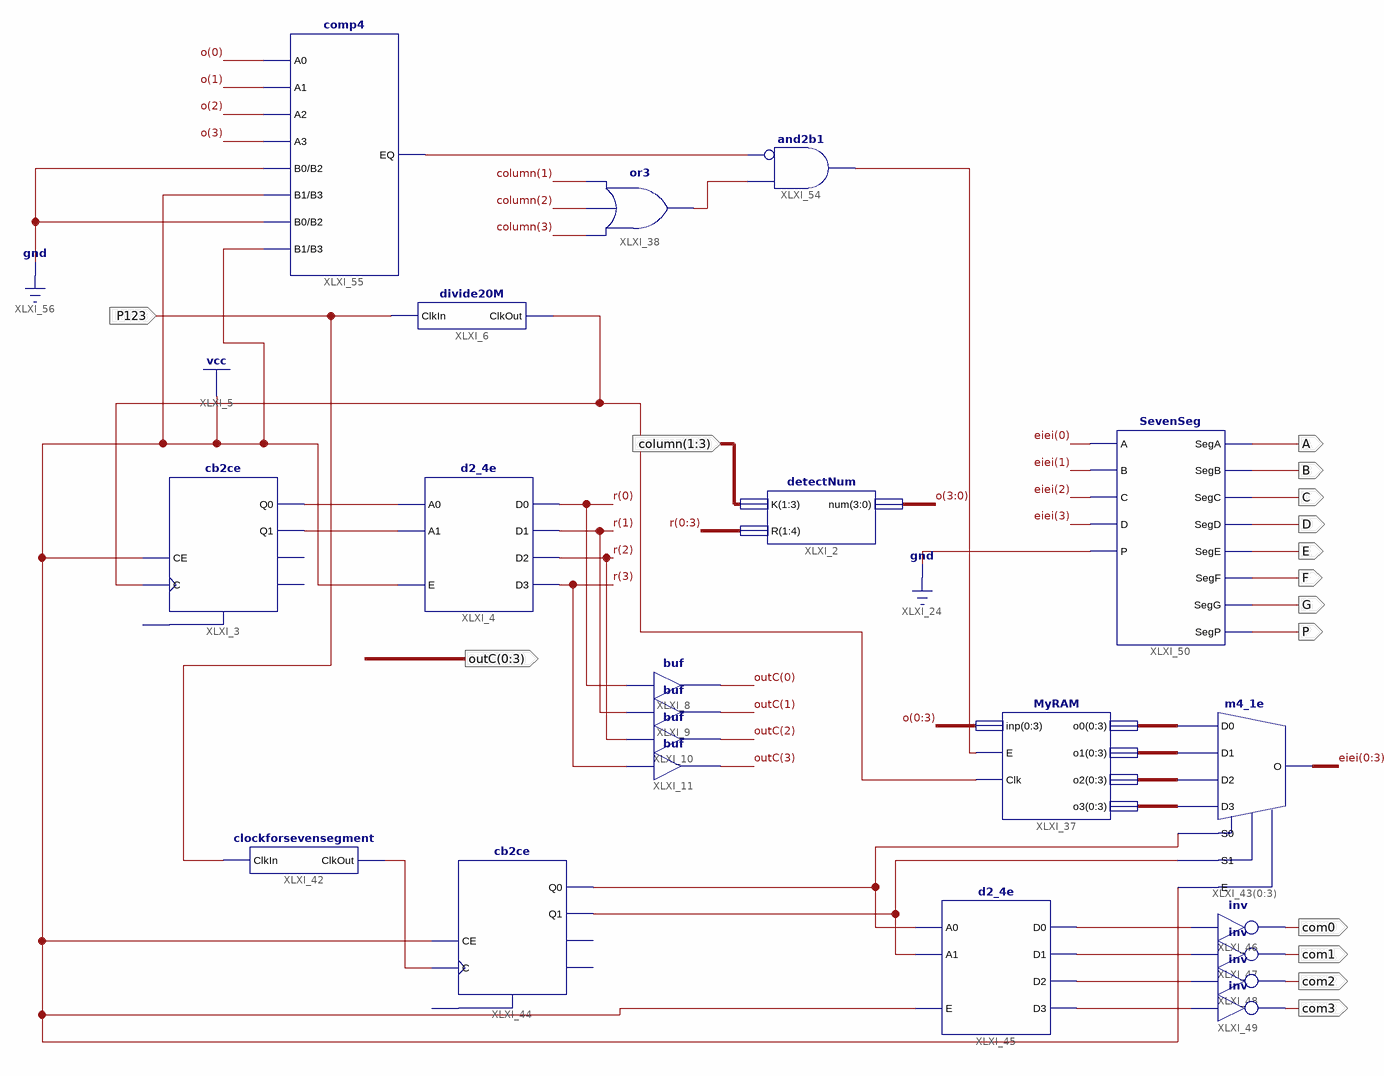
[diagram p0: schematic sheet 1]
// Xilinx ISE schematic res.sch (spartan6) as structural Verilog: 21 symbols, 15 ports
module res (
  input  [1:3] column,
  input  P123,
  output A,
  output B,
  output C,
  output D,
  output E,
  output F,
  output P,
  output G,
  output [0:3] outC,
  output com1,
  output com0,
  output com2,
  output com3
);

  wire XLXN_1, XLXN_2, XLXN_12, XLXN_139, XLXN_141, XLXN_154, XLXN_159, XLXN_160, XLXN_161, XLXN_162,
       XLXN_172, XLXN_173, XLXN_174;
  wire [3:0] eiei, o, r, XLXN_148, XLXN_149, XLXN_150, XLXN_151;

  detectNum XLXI_2 (.K(column), .R({r[0], r[1], r[2], r[3]}), .num(o));
  cb2ce XLXI_3 (.C(XLXN_12), .CE(1'b1), .Q0(XLXN_1), .Q1(XLXN_2));  // open: CLR, CEO, TC
  d2_4e XLXI_4 (.A0(XLXN_1), .A1(XLXN_2), .E(1'b1), .D0(r[0]), .D1(r[1]), .D2(r[2]), .D3(r[3]));
  divide20M XLXI_6 (.ClkIn(P123), .ClkOut(XLXN_12));
  buf XLXI_11 (outC[3], r[3]);
  buf XLXI_10 (outC[2], r[2]);
  buf XLXI_9 (outC[1], r[1]);
  buf XLXI_8 (outC[0], r[0]);
  or XLXI_38 (XLXN_172, column[3], column[2], column[1]);
  clockforsevensegment XLXI_42 (.ClkIn(P123), .ClkOut(XLXN_139));
  m4_1e XLXI_43[0:3] (
    .D0({XLXN_148[0], XLXN_148[1], XLXN_148[2], XLXN_148[3]}),
    .D1({XLXN_149[0], XLXN_149[1], XLXN_149[2], XLXN_149[3]}),
    .D2({XLXN_150[0], XLXN_150[1], XLXN_150[2], XLXN_150[3]}),
    .D3({XLXN_151[0], XLXN_151[1], XLXN_151[2], XLXN_151[3]}), .E(1'b1), .S0(XLXN_141), .S1(XLXN_154),
    .O({eiei[0], eiei[1], eiei[2], eiei[3]}));
  cb2ce XLXI_44 (.C(XLXN_139), .CE(1'b1), .Q0(XLXN_141), .Q1(XLXN_154));  // open: CLR, CEO, TC
  d2_4e XLXI_45 (.A0(XLXN_141), .A1(XLXN_154), .E(1'b1), .D0(XLXN_159), .D1(XLXN_160), .D2(XLXN_161), .D3(XLXN_162));
  not XLXI_46 (com0, XLXN_159);
  not XLXI_47 (com1, XLXN_160);
  not XLXI_48 (com2, XLXN_161);
  not XLXI_49 (com3, XLXN_162);
  SevenSeg XLXI_50 (
    .A(eiei[0]), .B(eiei[1]), .C(eiei[2]), .D(eiei[3]), .P(1'b0), .SegA(A), .SegB(B), .SegC(C), .SegD(D),
    .SegE(E), .SegF(F), .SegG(G), .SegP(P));
  MyRAM XLXI_37 (
    .Clk(XLXN_12), .E(XLXN_174), .inp({o[0], o[1], o[2], o[3]}),
    .o0({XLXN_148[0], XLXN_148[1], XLXN_148[2], XLXN_148[3]}),
    .o1({XLXN_149[0], XLXN_149[1], XLXN_149[2], XLXN_149[3]}),
    .o2({XLXN_150[0], XLXN_150[1], XLXN_150[2], XLXN_150[3]}),
    .o3({XLXN_151[0], XLXN_151[1], XLXN_151[2], XLXN_151[3]}));
  and XLXI_54 (XLXN_174, ~XLXN_173, XLXN_172);  // and2b1
  comp4 XLXI_55 (.A0(o[0]), .A1(o[1]), .A2(o[2]), .A3(o[3]), .B0(1'b0), .B1(1'b1), .B2(1'b0), .B3(1'b1), .EQ(XLXN_173));
endmodule
